# EAGLE design mister_case_top (EAGLE 9.6.2)
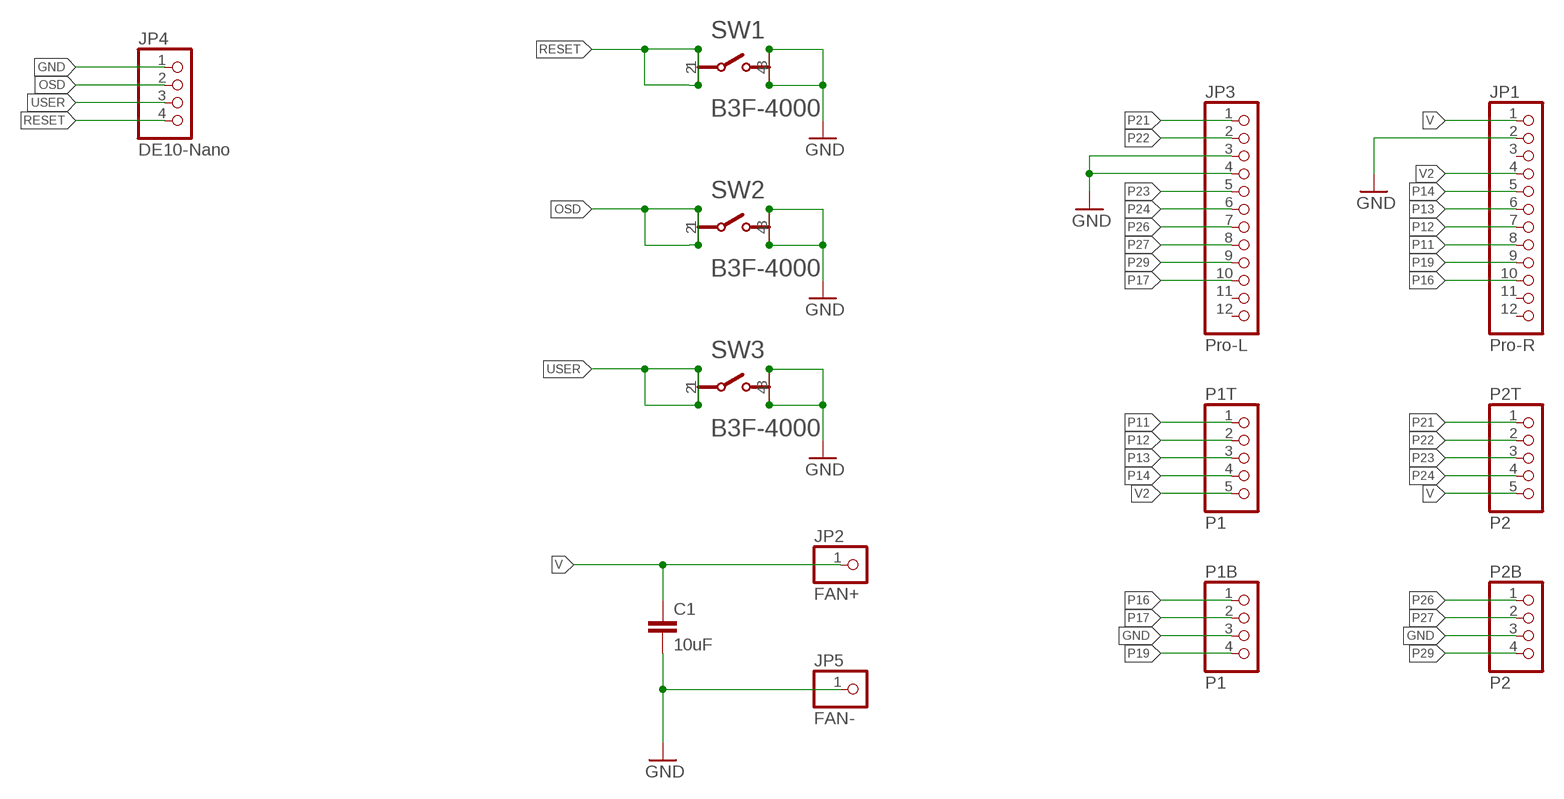
[diagram p0: schematic, sheet 1]

## Parts
C1  10uF  C-EUC0805  [C0805]
JP1  Pro-R  PINHD-1X12-NOHOLESNOHOLES  [1X12L-NOHOLES]
JP2  FAN+  PINHD-1X1  [1X01]
JP3  Pro-L  PINHD-1X12-NOHOLESNOHOLES  [1X12L-NOHOLES]
JP4  DE10-Nano  PINHD-1X4  [1X04]
JP5  FAN-  PINHD-1X1  [1X01]
P1B  P1  PINHD-1X4  [1X04]
P1T  P1  PINHD-1X5  [1X05]
P2B  P2  PINHD-1X4  [1X04]
P2T  P2  PINHD-1X5  [1X05]
SW1  OMRON_B3F-4000  [OMRON_B3F-4000_NOHOLES]
SW2  OMRON_B3F-4000  [OMRON_B3F-4000_NOHOLES]
SW3  OMRON_B3F-4000  [OMRON_B3F-4000_NOHOLES]

## Nets
GND: C1.2 JP1.2 JP3.3 JP3.4 JP4.1 JP5.1 P1B.3 P2B.3 SW1.3 SW1.4 SW2.3 SW2.4 SW3.3 SW3.4
OSD: JP4.2 SW2.1 SW2.2
P11: JP1.8 P1T.1
P12: JP1.7 P1T.2
P13: JP1.6 P1T.3
P14: JP1.5 P1T.4
P16: JP1.10 P1B.1
P17: JP3.10 P1B.2
P19: JP1.9 P1B.4
P21: JP3.1 P2T.1
P22: JP3.2 P2T.2
P23: JP3.5 P2T.3
P24: JP3.6 P2T.4
P26: JP3.7 P2B.1
P27: JP3.8 P2B.2
P29: JP3.9 P2B.4
RESET: JP4.4 SW1.1 SW1.2
USER: JP4.3 SW3.1 SW3.2
V: C1.1 JP1.1 JP2.1 P2T.5
V2: JP1.4 P1T.5
Unconnected: JP1.3 JP1.11 JP1.12 JP3.11 JP3.12

## Library data of the parts
C1 = rcl:C-EU: CAPACITOR, European symbol; SPICEPREFIX: C
JP1 JP3 = modified:PINHD-1X12-NOHOLES: PIN HEADER
JP2 JP5 = pinhead:PINHD-1X1: PIN HEADER
JP4 = modified:PINHD-1X4: PIN HEADER
P1B P2B = pinhead:PINHD-1X4: PIN HEADER
P1T P2T = pinhead:PINHD-1X5: PIN HEADER
SW1-SW3 = Omron - B3F-4000:OMRON_B3F-4000: SWITCH TACTILE SPST-NO 0.05A 24V

## Board
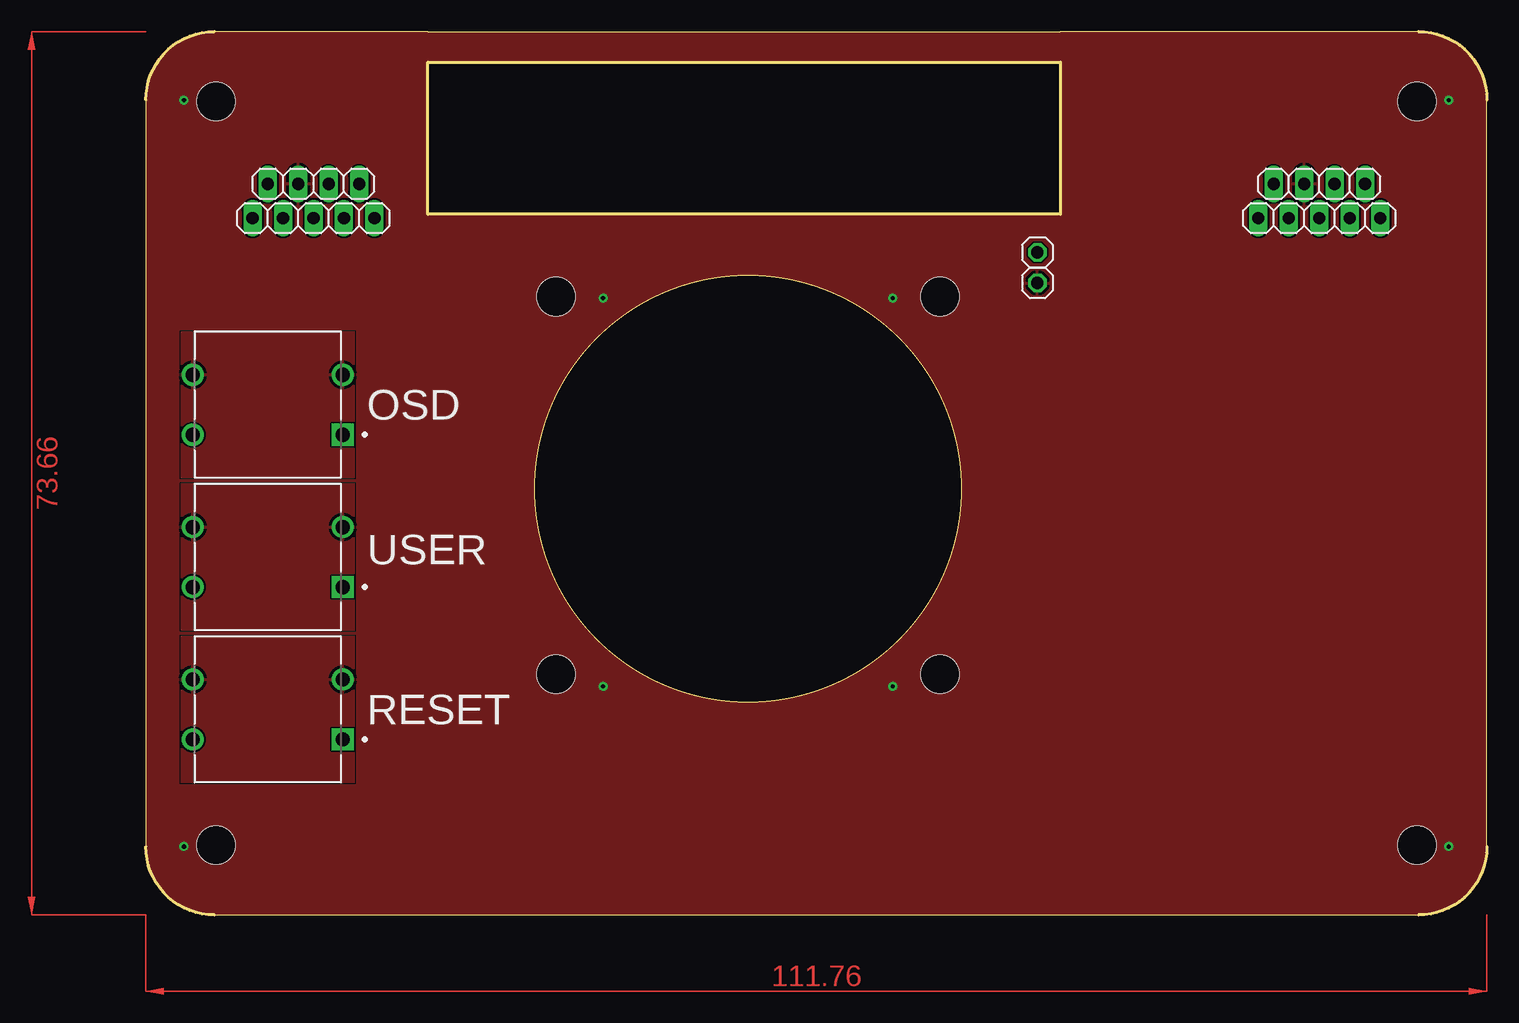
[diagram p1: board, top side]
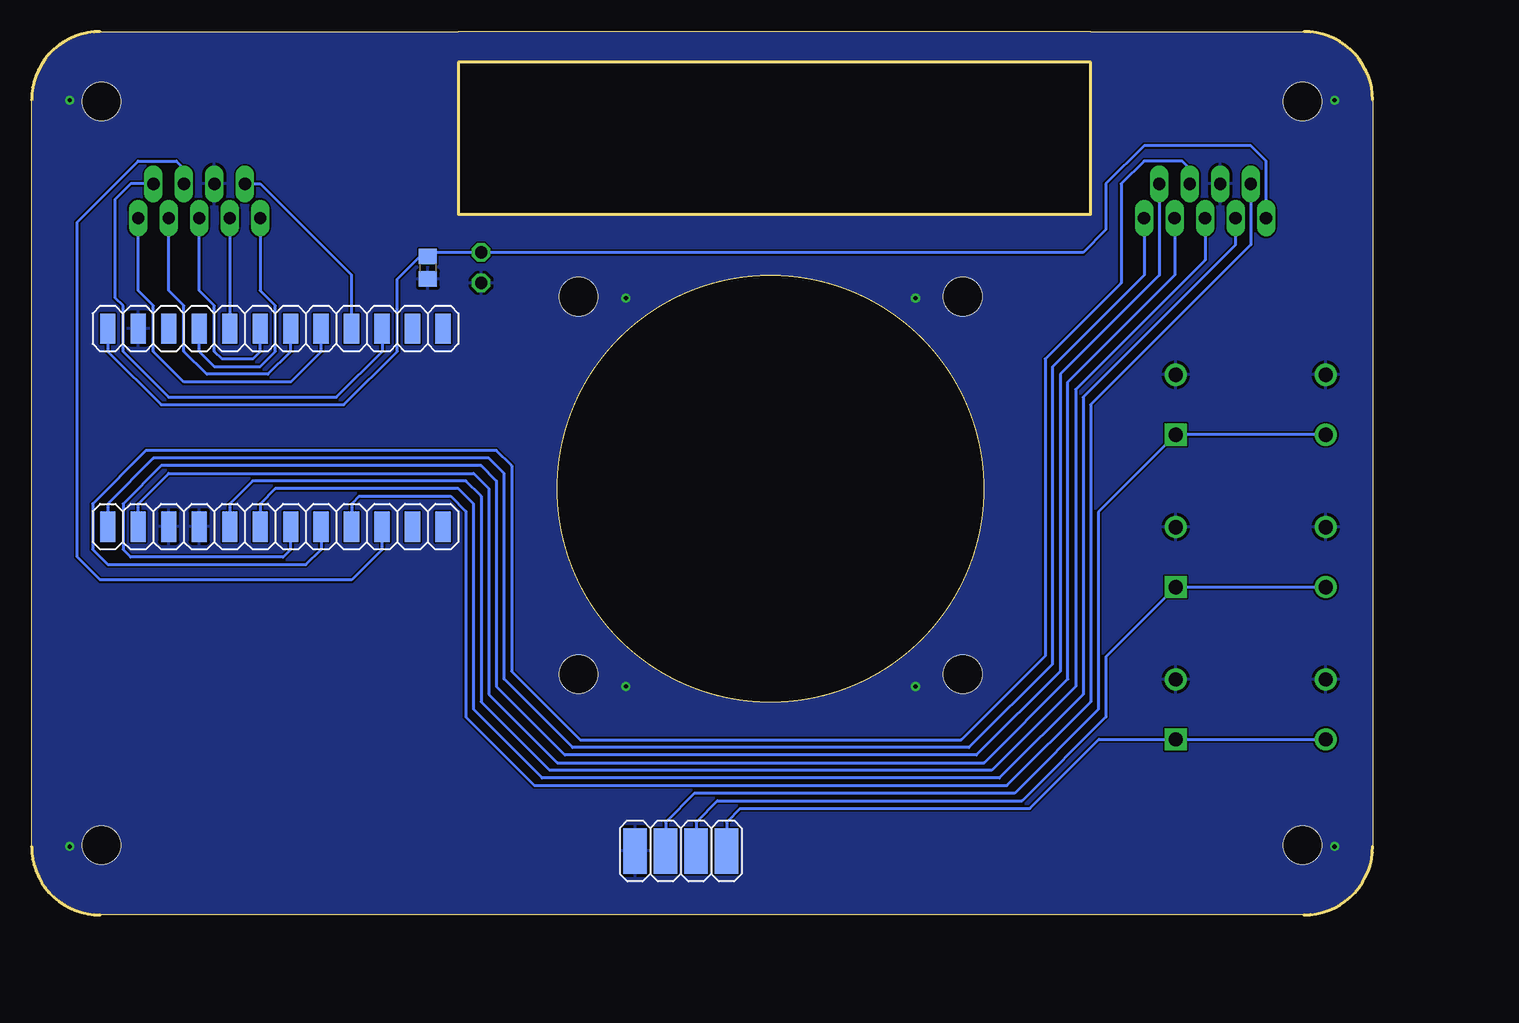
[diagram p2: board, bottom side, seen from below]

Size 111.76 x 73.66 mm. Coordinates in mm from the lower left corner, seen from the top.
Outline: 5.71,0 106.05,0 arc90 111.76,5.71 111.76,67.95 arc90 106.05,73.66 76.2,73.66 23.49,73.66 5.71,73.66 arc90 0,67.95 0,5.71 arc90 5.71,0
Outline: circle at 50.16,35.56 radius 17.78
Copper layers (1*16): Top 0.035mm / dielectric 1.5mm / Bottom 0.035mm
Design rules "default *": minimum track width 6mil, minimum drill 0.35mm, track to track 6mil, track to pad 6mil, pad to pad 6mil, via to via 6mil, smd to smd 6mil, copper to edge 0.002540625mm, drill to drill 6mil, minimum pad ring 10mil, minimum via ring 8mil, stop-mask expansion 4mil, vias tented up to drill 0mil, thermal gap 10mil
Holes 3.2 mm at 5.84,67.82 105.92,67.82 105.92,5.84 34.16,51.56 66.17,51.56 66.17,20.07 34.16,20.07 5.84,5.84

### Footprints (pad centres in the part's own frame; a part is rotated, then mirrored left to right if it is on the bottom)
C0805 = smd 1.3 x 1.5: 1 -0.95,0; 2 0.95,0
1X12L-NOHOLES = smd 1.27 x 2.54: 1 -13.97,0.635; 2 -11.43,0.635; 3 -8.89,0.635; 4 -6.35,0.635; 5 -3.81,0.635; 6 -1.27,0.635; 7 1.27,0.635; 8 3.81,0.635; 9 6.35,0.635; 10 8.89,0.635; 11 11.43,0.635; 12 13.97,0.635
1X01 = drill 1.016 octagon: 1 0,0
1X04 = smd 1.93 x 3.81: 1 -3.81,-1.27; 2 -1.27,-1.27; 3 1.27,-1.27; 4 3.81,-1.27
1X04' = drill 1.016 long: 1 -3.81,0; 2 -1.27,0; 3 1.27,0; 4 3.81,0
1X05 = drill 1.016 long: 1 -5.08,0; 2 -2.54,0; 3 0,0; 4 2.54,0; 5 5.08,0
OMRON_B3F-4000_NOHOLES = drill 1.2 pad 1.85 square: 1 -6.25,2.5 | drill 1.2 pad 1.85: 2 6.25,2.5; 3 -6.25,-2.5; 4 6.25,-2.5

### Placement (x,y rotation side)
C1  78.74,53.98 270 bottom
JP1  91.44,48.26 0 bottom
JP2  74.3,55.24 0 top
JP3  91.44,31.75 0 bottom
JP4  57.66,6.6 0 bottom
JP5  74.3,52.7 0 top
P1B  P1  [1X04']  97.79,60.96 180 top
P1T  97.79,58.1 180 top
P2B  P2  [1X04']  13.97,60.96 180 top
P2T  13.97,58.1 180 top
SW1  10.16,17.14 180 top
SW2  10.16,42.55 180 top
SW3  10.16,29.84 180 top

### Tracks (layer width: path | path; a pad name or v marks a point on that pad's centre or on a via)
GND  (via drill 0.35)
  other vias: 62.23,19.05 38.1,19.05 38.1,51.44 62.23,51.44 3.17,67.95 108.59,67.95 108.59,5.71 3.17,5.71
  pour Bottom: -8.25,74.3 -8.25,0 0.64,-8.89 112.4,-8.89 120.02,-1.27 120.02,73.03 112.4,80.65 -1.91,80.65
  pour Top: -6.99,73.66 -6.99,1.91 2.54,-7.62 111.12,-7.62 118.75,0 118.75,71.76 111.12,79.38 -1.27,79.38
OSD
  Bottom 0.254: JP4.2 58.93,7.75 56.52,10.16 29.84,10.16 22.86,17.14 22.86,33.59 SW2.1 SW2.2
P11
  Bottom 0.254: P1T.1 102.87,52.07 101.6,50.8 101.6,46.99 99.06,44.45 90.17,44.45 87.63,46.99 JP1.8
P12
  Bottom 0.254: P1T.2 100.33,52.07 99.06,50.8 99.06,46.99 97.16,45.09 92.08,45.09 90.17,46.99 JP1.7
P13
  Bottom 0.254: P1T.3 97.79,52.07 96.52,50.8 96.52,46.99 95.89,46.35 93.35,46.35 92.71,46.99 JP1.6
P14
  Bottom 0.254: P1T.4 JP1.5
P16
  Bottom 0.254: JP1.10 82.55,46.99 86.36,43.18 100.33,43.18 104.14,46.99 104.14,50.8 104.78,51.44 104.78,59.69 103.51,60.96 P1B.1
P17
  Bottom 0.254: P1B.2 99.06,62.23 99.7,62.87 102.87,62.87 107.95,57.78 107.95,29.84 106.05,27.94 85.09,27.94 82.55,30.48 JP3.10
P19
  Bottom 0.254: P1B.4 92.71,60.96 85.09,53.34 JP1.9
P21
  Bottom 0.254: P2T.1 19.05,53.34 26.67,45.72 26.67,20.95 33.66,13.97 66.68,13.97 72.39,19.68 72.39,36.83 73.66,38.1 101.6,38.1 105.41,34.29 JP3.1
P22
  Bottom 0.254: P2T.2 16.51,53.34 25.4,44.45 25.4,19.68 32.38,12.7 67.95,12.7 73.66,18.41 73.66,35.56 74.93,36.83 100.33,36.83 102.87,34.29 JP3.2
P23
  Bottom 0.254: P2T.3 13.97,54.61 24.77,43.81 24.77,19.05 31.75,12.07 68.58,12.07 74.3,17.78 74.3,34.92 75.57,36.2 93.35,36.2 95.25,34.29 JP3.5
P24
  Bottom 0.254: JP3.6 92.71,34.29 91.44,35.56 76.2,35.56 74.93,34.29 74.93,17.14 69.22,11.43 31.11,11.43 24.13,18.41 24.13,43.18 11.43,55.88 P2T.4
P26
  Bottom 0.254: P2B.1 17.78,53.34 26.04,45.09 26.04,20.32 33.02,13.34 67.31,13.34 73.03,19.05 73.03,36.2 74.3,37.46 100.97,37.46 104.14,34.29 104.14,30.48 103.51,29.84 90.81,29.84 90.17,30.48 JP3.7
P27
  Bottom 0.254: JP3.8 87.63,30.48 88.9,29.21 105.41,29.21 106.68,30.48 106.68,34.29 102.23,38.73 73.03,38.73 71.76,37.46 71.76,20.32 66.04,14.61 34.29,14.61 27.3,21.59 27.3,46.35 20.95,52.7 20.95,60.96 19.05,62.87 15.88,62.87 15.24,62.23 P2B.2
P29
  Bottom 0.254: JP3.9 85.09,34.29 84.46,34.92 76.84,34.92 75.57,33.66 75.57,16.51 69.85,10.8 30.48,10.8 23.49,17.78 23.49,42.55 10.16,55.88 P2B.4
RESET
  Bottom 0.254: JP4.4 53.85,7.75 52.7,8.89 28.57,8.89 22.82,14.64 SW1.1 SW1.2
USER
  Bottom 0.254: JP4.3 56.39,7.75 54.61,9.53 29.21,9.53 22.22,16.51 22.22,21.53 SW3.1 SW3.2
V
  Bottom 0.254: P2T.5 8.89,62.87 10.16,64.14 19.05,64.14 22.22,60.96 22.22,57.15 24.13,55.24 JP2.1 78.42,55.24 C1.1 79.38,54.92 81.28,53.02 81.28,46.99 85.73,42.55 100.97,42.55 105.41,46.99 JP1.1
V2
  Bottom 0.254: P1T.5 92.71,52.07 91.44,50.8 91.44,46.99 92.71,45.72 96.52,45.72 97.79,46.99 JP1.4
(copper drawn outside any net)
  shapes: Top area x2

### Text on the board
tPlace: OSD | USER | RESET